# EAGLE design TinyRX4 (EAGLE 6.4)
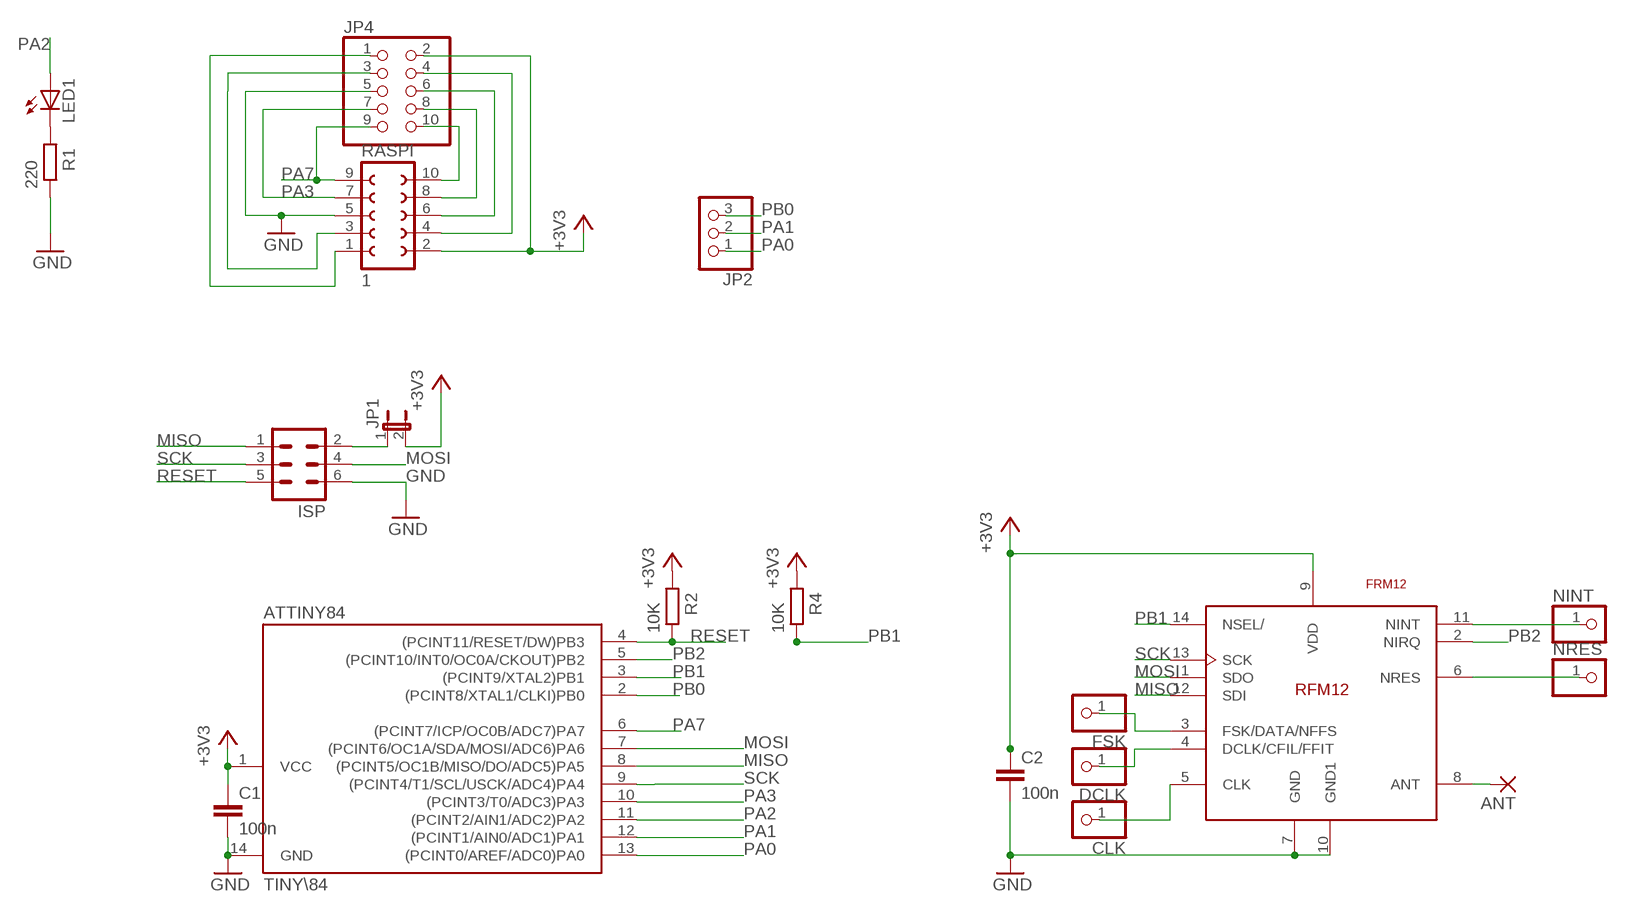
[diagram p0: schematic, sheet 1]

## Parts
ANT  1,6/0,8  [1,6/0,8]
ATTINY84  TINY\84  TINY24/44/84-SSU  [SOIC14]
C1  100n  C-EUC0805  [C0805]
C2  100n  C-EUC0805  [C0805]
CLK  PINHD-1X1  [1X01]
DCLK  PINHD-1X1  [1X01]
FSK  PINHD-1X1  [1X01]
ISP  ML6  [ML6]
JP1  JUMPER-2PTH  [1X02]
JP2  PINHD-1X3  [1X03]
JP4  PINHD-2X5  [2X05]
LED1  LEDSML0805  [SML0805]
NINT  PINHD-1X1  [1X01]
NRES  PINHD-1X1  [1X01]
R1  220  R-EU_R0805  [R0805]
R2  10K  R-EU_R0805  [R0805]
R4  10K  R-EU_R0805  [R0805]
RASPI  1  FE05-2  [FE05-2]
U$1  FRM12  [RFM12]

## Nets
+3V3 [power]: ATTINY84.1(VCC) C1.1 C2.1 JP1.2 JP4.2 R2.2 R4.2 RASPI.2 U$1.9(VDD)
GND [power]: ATTINY84.14(GND) C1.2 C2.2 ISP.6 JP4.5 R1.1 RASPI.5 U$1.7(GND) U$1.10(GND1)
MISO: ATTINY84.8((PCINT5/OC1B/MISO/DO/ADC5)PA5) ISP.1 U$1.12(SDI)
MOSI: ATTINY84.7((PCINT6/OC1A/SDA/MOSI/ADC6)PA6) ISP.4 U$1.1(SDO)
N$1: ISP.2 JP1.1
N$2: JP4.10 RASPI.10
N$3: LED1.C R1.2
N$4: JP4.8 RASPI.8
N$5: JP4.6 RASPI.6
N$6 [power]: ANT.1(P) U$1.8(ANT)
N$7: JP4.4 RASPI.4
N$9: JP4.1 RASPI.1
N$10: JP4.3 RASPI.3
N$15: NINT.1 U$1.11(NINT)
N$16: CLK.1 U$1.5(CLK)
N$17: DCLK.1 U$1.4(DCLK/CFIL/FFIT)
N$18: NRES.1 U$1.6(NRES)
N$19: FSK.1 U$1.3(FSK/DATA/NFFS)
PA0: ATTINY84.13((PCINT0/AREF/ADC0)PA0) JP2.1
PA1 [power]: ATTINY84.12((PCINT1/AIN0/ADC1)PA1) JP2.2
PA2: ATTINY84.11((PCINT2/AIN1/ADC2)PA2) LED1.A
PA3: ATTINY84.10((PCINT3/T0/ADC3)PA3) JP4.7 RASPI.7
PA7: ATTINY84.6((PCINT7/ICP/OC0B/ADC7)PA7) JP4.9 RASPI.9
PB0: ATTINY84.2((PCINT8/XTAL1/CLKI)PB0) JP2.3
PB1: ATTINY84.3((PCINT9/XTAL2)PB1) R4.1 U$1.14(NSEL/)
PB2: ATTINY84.5((PCINT10/INT0/OC0A/CKOUT)PB2) U$1.2(NIRQ)
RESET: ATTINY84.4((PCINT11/RESET/DW)PB3) ISP.5 R2.1
SCK: ATTINY84.9((PCINT4/T1/SCL/USCK/ADC4)PA4) ISP.3 U$1.13(SCK)

## Library data of the parts
ANT = JeeLabs:1,6/0,8: THROUGH-HOLE PAD
ATTINY84 = avr-7:TINY24/44/84
C1 C2 = rcl:C-EU: CAPACITOR, European symbol
CLK DCLK FSK NINT NRES = pinhead:PINHD-1X1: PIN HEADER
ISP = con-harting-ml:ML6: HARTING; OC_FARNELL: unknown; OC_NEWARK: unknown
JP1 = SparkFun:JUMPER-2: Jumper Basic 0.1" spaced jumper. Use with breakaway headers.
JP2 = pinhead:PINHD-1X3: PIN HEADER
JP4 = pinhead:PINHD-2X5: PIN HEADER
LED1 = led:LED: LED OSRAM: - CHIPLED LG R971, LG N971, LY N971, LG Q971, LY Q971, LO R971, LY R971 LH N974, LH R974 LS Q976, LO Q976, LY Q976 LO Q996 - Hyper CHIPLED LW Q18S LB Q993, LB Q99A, LB R99A - SideLED LS A670, LO A670, LY A670, LG A670, LP A670 LB A673, LV A673, LT A673, LW A673 LH A674 LY A675 LS A676, LA A676, LO A676, LY A676, LW A676 LS A679, LY A679, LG A679 - Hyper Micro SIDELED® LS Y876, LA Y876, LO Y876, LY Y876 LT Y87S - SmartLED LW L88C, LW L88S LB L89C, LB L89S, LG L890 LS L89K, LO L89K, LY L89K LS L896, LA L896, LO L896, LY L896 - TOPLED LS T670, LO T670, LY T670, LG T670, LP T670 LSG T670, LSP T670, LSY T670, LOP T670, LYG T670 LG T671, LOG T671, LSG T671 LB T673, LV T673, LT T673, LW T673 LH T674 LS T676, LA T676, LO T676, LY T676, LB T676, LH T676, LSB T676, LW T676 LB T67C, LV T67C, LT T67C, LS T67K, LO T67K, LY T67K, LW E67C LS E67B, LA E67B, LO E67B, LY E67B, LB E67C, LV E67C, LT E67C LW T67C LS T679, LY T679, LG T679 LS T770, LO T770, LY T770, LG T770, LP T770 LB T773, LV T773, LT T773, LW T773 LH T774 LS E675, LA E675, LY E675, LS T675 LS T776, LA T776, LO T776, LY T776, LB T776 LHGB T686 LT T68C, LB T68C - Hyper Mini TOPLED® LB M676 - Mini TOPLED Santana® LG M470 LS M47K, LO M47K, LY M47K Source: http://www.osram.convergy.de LUXEON: - LUMILED® LXK2-PW12-R00, LXK2-PW12-S00, LXK2-PW14-U00, LXK2-PW14-V00 LXK2-PM12-R00, LXK2-PM12-S00, LXK2-PM14-U00 LXK2-PE12-Q00, LXK2-PE12-R00, LXK2-PE12-S00, LXK2-PE14-T00, LXK2-PE14-U00 LXK2-PB12-K00, LXK2-PB12-L00, LXK2-PB12-M00, LXK2-PB14-N00, LXK2-PB14-P00, LXK2-PB14-Q00 LXK2-PR12-L00, LXK2-PR12-M00, LXK2-PR14-Q00, LXK2-PR14-R00 LXK2-PD12-Q00, LXK2-PD12-R00, LXK2-PD12-S00 LXK2-PH12-R00, LXK2-PH12-S00 LXK2-PL12-P00, LXK2-PL12-Q00, LXK2-PL12-R00 Source: www.luxeon.com KINGBRIGHT: KA-3528ASYC Source: www.kingbright.com
R1 R2 R4 = rcl:R-EU_: RESISTOR, European symbol
RASPI = con-lsta:FE05-2: FEMALE HEADER; OC_FARNELL: unknown; OC_NEWARK: unknown
U$1 = RFM12:FRM12

## Net classes
0 default: width 0.254 mm, drill 0.254 mm, clearance 0.254 mm
1 power: width 0.305 mm, drill 0.305 mm, clearance 0.305 mm

## Board
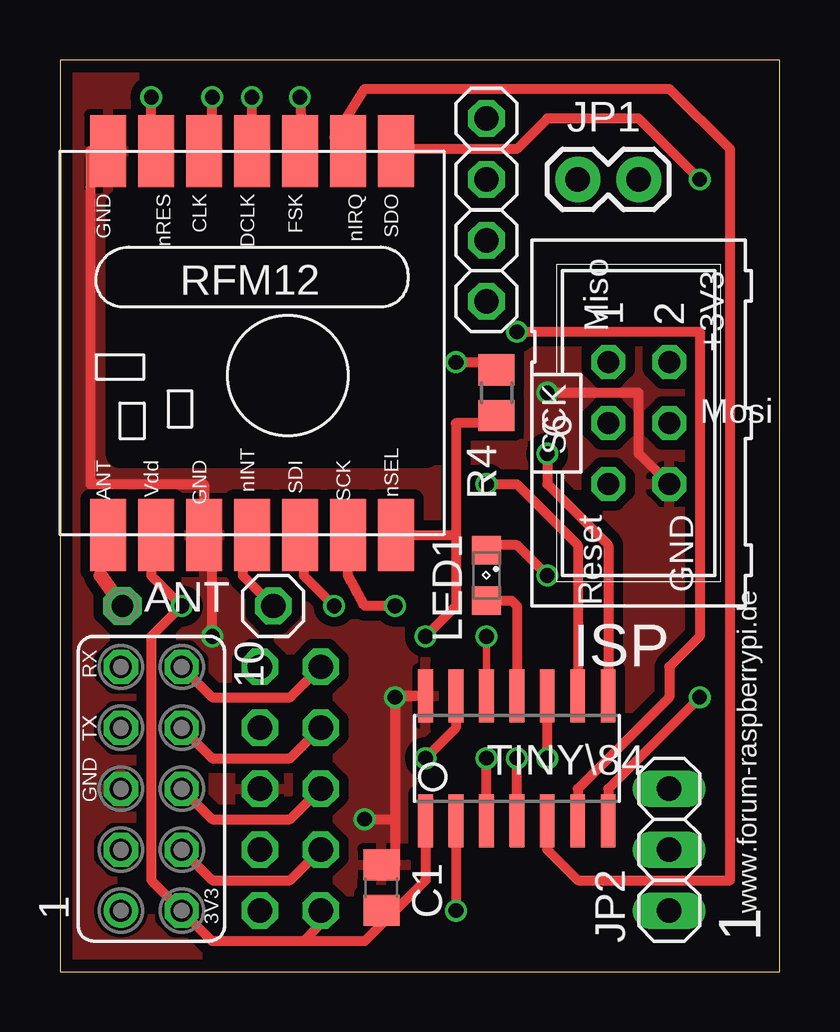
[diagram p1: board, top side]
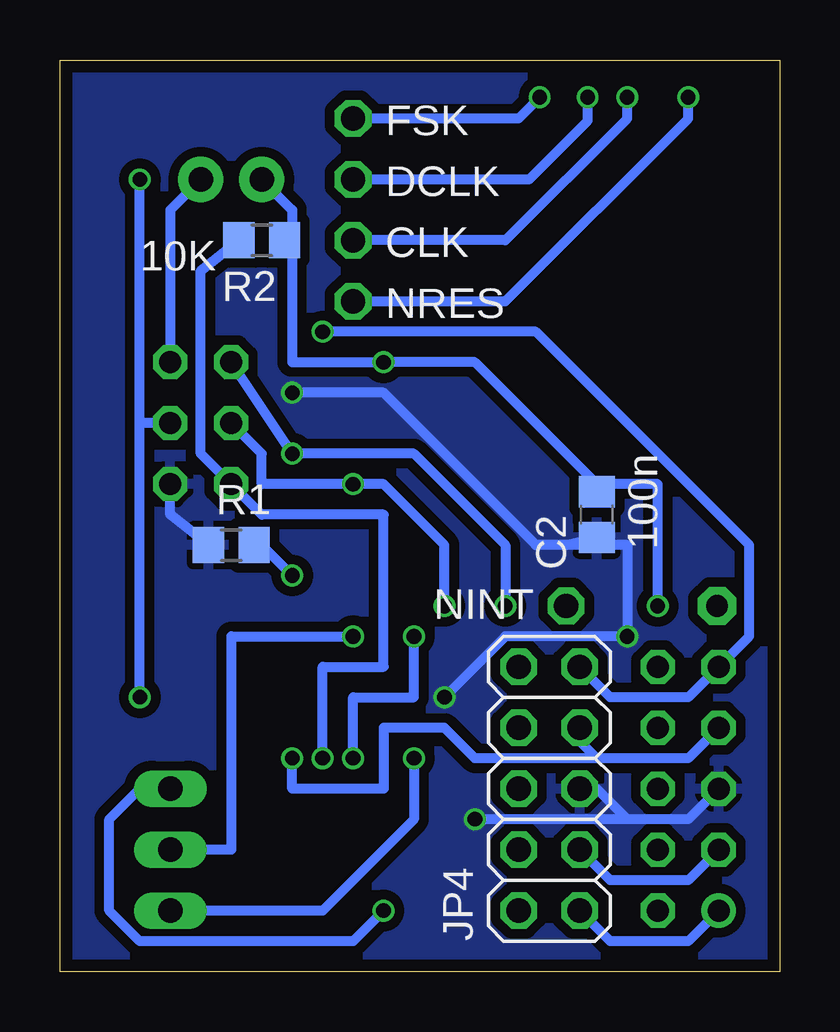
[diagram p2: board, bottom side, seen from below]

Size 30 x 38 mm. Coordinates in mm from the lower left corner, seen from the top.
Outline: 0,0 30,0 30,38 0,38 0,0
Copper layers (1*16): Top 0.035mm / dielectric 1.5mm / Bottom 0.035mm
Design rules "smartprototyping": minimum track width 7mil, minimum drill 12mil, track to track 7mil, track to pad 7mil, pad to pad 7mil, via to via 7mil, smd to smd 0mil, copper to edge 20mil, drill to drill 10mil, minimum pad ring 10mil, minimum via ring 6mil, stop-mask expansion 2mil, vias tented up to drill 25mil, thermal gap 10mil
tRestrict: area 2.5,21.6 to 15.2,32

### Footprints (pad centres in the part's own frame; a part is rotated, then mirrored left to right if it is on the bottom)
1,6/0,8 = drill 0.9 pad 1.6 octagon: 1 0,0
SOIC14 = smd 0.61 x 2.21: 1 -3.81,-2.603; 2 -2.54,-2.603; 3 -1.27,-2.603; 4 0,-2.603; 5 1.27,-2.603; 6 2.54,-2.603; 7 3.81,-2.603; 8 3.81,2.603; 9 2.54,2.603; 10 1.27,2.603; 11 0,2.603; 12 -1.27,2.603; 13 -2.54,2.603; 14 -3.81,2.603
C0805 = smd 1.3 x 1.5: 1 -0.95,0; 2 0.95,0
1X01 = drill 1.016 octagon: 1 0,0
ML6 = drill 0.914 octagon: 1 -2.54,-1.27; 2 -2.54,1.27; 3 0,-1.27; 4 0,1.27; 5 2.54,-1.27; 6 2.54,1.27
1X02 = drill 1.016 pad 1.88: 1 0,0; 2 2.54,0
1X03 = drill 1.016 long: 1 -2.54,0; 2 0,0; 3 2.54,0
2X05 = drill 1.016 octagon: 1 -5.08,-1.27; 2 -5.08,1.27; 3 -2.54,-1.27; 4 -2.54,1.27; 5 0,-1.27; 6 0,1.27; 7 2.54,-1.27; 8 2.54,1.27; 9 5.08,-1.27; 10 5.08,1.27
SML0805 = smd 1.2 x 1.2: A 1.05,0; C -1.05,0
R0805 = smd 1.3 x 1.5: 1 -0.95,0; 2 0.95,0
FE05-2 = drill 0.914: 1 -5.08,1.27 | drill 0.914 octagon: 2 -5.08,-1.27; 3 -2.54,1.27; 4 -2.54,-1.27; 5 0,1.27; 6 0,-1.27; 7 2.54,1.27; 8 2.54,-1.27; 9 5.08,1.27; 10 5.08,-1.27
RFM12 = smd 1.5 x 3: 1 -5,-10; 2 -3,-10; 3 -1,-10; 4 1,-10; 5 3,-10; 6 5,-10; 7 7,-10; 8 7,6; 9 5,6; 10 3,6; 11 1,6; 12 -1,6; 13 -3,6; 14 -5,6

### Placement (x,y rotation side)
ANT  2.6,15.24 0 top
ATTINY84  19.05,8.89 0 top
C1  13.4,3.5 90 top
C2  7.62,19.05 270 bottom
CLK  17.78,30.48 0 top
DCLK  17.78,33.02 0 top
FSK  17.78,35.56 0 top
ISP  24.13,22.86 270 top
JP1  24.13,33.02 180 top
JP2  25.4,5.08 90 top
JP4  9.6,7.62 90 bottom
LED1  17.78,16.51 270 top
NINT  8.89,15.24 0 top
NRES  17.78,27.94 0 top
R1  22.86,17.78 0 bottom
R2  21.59,30.48 0 bottom
R4  18.2,24.13 90 top
RASPI  3.81,7.62 90 top
U$1  9,24.2 180 top

### Tracks (layer width: path | path; a pad name or v marks a point on that pad's centre or on a via)
+3V3  (via drill 0.61)
  Top 0.406: ATTINY84.1 15.24,3.81 13.97,2.54 | 13.97,2.54 12.7,1.27 10.16,1.27 | 10.16,1.27 6.35,1.27 RASPI.2 3.81,3.81 3.81,13.97 v5.08,15.24 3.81,16.51 3.81,18.67 4,18.67 U$1.9 | C1.1 13.65,2.86 13.97,2.54 | JP4.2 10.87,1.98 10.16,1.27 | v16.51,25.4 17.78,25.4 R4.2
  Bottom 0.406: v5.08,15.24 5.08,20.32 7.62,20.32 | JP1.2 20.32,31.75 20.32,30.48 | 20.32,30.48 20.32,25.4 v16.51,25.4 12.7,25.4 7.62,20.32 | 7.62,20.32 C2.1 | R2.2 20.32,30.48
GND  (via drill 0.61)
  Top 0.406: ISP.6 24.13,21.59 24.13,24.13 v20.32,24.13 | v13.97,11.43 ATTINY84.14 13.97,11.49 v13.97,11.43 | v13.97,11.43 13.97,6.35 | 13.97,6.35 13.97,4.45 C1.2 | v12.7,6.35 13.97,6.35 | U$1.10 6.35,18.5 | U$1.10 6.35,18.15 v6.35,13.97 | U$1.10 6,20.32 1.27,20.32 1.27,34.2 U$1.7
  Bottom 0.406: RASPI.5 3.81,6.35 6.35,6.35 | 6.35,6.35 v12.7,6.35 | R1.1 25.4,19.05 ISP.6 | v20.32,24.13 16.51,24.13 10.16,17.78 8.89,17.78 | 8.89,17.78 6.35,17.78 v6.35,13.97 11.43,13.97 v13.97,11.43 | 8.89,17.78 C2.2 | JP4.5 7.62,7.62 6.35,6.35
  pour Bottom (isolate 0.406): 0,38.1 30.48,38.1 30.48,0 0,0
  pour Top (isolate 0.406): 30.48,0 0,0 0,38.1 30.48,38.1
MISO  (via drill 0.61)
  Top 0.254: 22.86,11.43 ATTINY84.8
  Top 0.406: v20.32,21.59 20.32,20.32 22.86,17.78 ATTINY84.8 | U$1.12 10.16,18.5 10.16,16.51 v11.43,15.24
  Bottom 0.406: ISP.1 v20.32,21.59 15.24,21.59 11.43,17.78 v11.43,15.24
MOSI  (via drill 0.61)
  Top 0.254: 13.97,34.29 U$1.1
  Top 0.406: v26.67,33.02 24.13,35.56 20.32,35.56 19.05,34.29 13.97,34.29 | v26.67,11.43 22.86,7.62 ATTINY84.7
  Bottom 0.406: 26.67,22.86 v26.67,33.02 | v26.67,11.43 26.67,22.86 | ISP.4 26.67,22.86
N$1
  Bottom 0.406: JP1.1 25.4,31.75 ISP.2
N$2
  Top 0.406: RASPI.10 6.35,11.43 9.6,11.43 JP4.10
N$3  (via drill 0.61)
  Top 0.406: v20.32,16.51 19.05,17.78 17.78,17.78 LED1.C
  Bottom 0.406: v20.32,16.51 21.59,17.78 R1.2
N$4
  Top 0.406: RASPI.8 6.35,8.89 9.6,8.89 JP4.8
N$5
  Top 0.406: RASPI.6 6.35,6.35 9.6,6.35 JP4.6
N$6
  Top 0.406: U$1.8 1.7,18.5 1.7,16.51
  Top 0.61: ANT.1 1.7,16.51
N$7
  Top 0.406: RASPI.4 6.35,3.81 9.6,3.81 JP4.4
N$9
  Bottom 0.406: RASPI.1 3.81,1.27 7.06,1.27 JP4.1
N$10
  Bottom 0.406: RASPI.3 3.81,3.81 7.06,3.81 JP4.3
N$15
  Top 0.406: U$1.11 7.62,18.5 7.62,16.51 NINT.1
N$16  (via drill 0.61)
  Top 0.406: U$1.5 6.35,34.5 v6.35,36.45
  Bottom 0.406: CLK.1 11.43,30.48 6.35,35.56 v6.35,36.45
N$17  (via drill 0.61)
  Top 0.406: 7.62,34.2 U$1.4 v8,36.45
  Bottom 0.406: DCLK.1 10.45,33.02 8,35.47 v8,36.45
N$18  (via drill 0.61)
  Top 0.406: U$1.6 3.81,34.5 v3.81,36.45
  Bottom 0.406: NRES.1 11.43,27.94 3.81,35.56 v3.81,36.45
N$19  (via drill 0.61)
  Top 0.406: U$1.3 10.16,34.5 v10,36.45
  Bottom 0.406: FSK.1 10.89,35.56 v10,36.45
PA0  (via drill 0.61)
  Top 0.406: ATTINY84.13 16.51,10.16 v15.24,8.89
  Bottom 0.406: v15.24,8.89 15.24,6.35 19.05,2.54 JP2.1
PA1  (via drill 0.61)
  Top 0.305: v17.78,13.97 ATTINY84.12
  Bottom 0.406: v17.78,13.97 22.86,13.97 22.86,5.08 JP2.2
PA2
  Top 0.254: 19.05,11.43 ATTINY84.11
  Top 0.406: LED1.A 18.83,15.46 19.05,15.24 ATTINY84.11
PA3  (via drill 0.61)
  Top 0.406: v20.32,8.89 ATTINY84.10
  Bottom 0.406: RASPI.7 3.81,8.89 7.62,8.89 | 7.62,8.89 12.7,8.89 13.97,10.16 16.51,10.16 16.51,7.62 20.32,7.62 v20.32,8.89 | JP4.7 8.33,9.6 7.62,8.89
PA7  (via drill 0.61)
  Top 0.406: ATTINY84.6 21.59,7.62 25.4,11.43 25.4,12.7 26.67,13.97 26.67,26.67 v19.05,26.67
  Bottom 0.406: v19.05,26.67 10.16,26.67 1.27,17.78 1.27,13.97 RASPI.9 3.81,11.43 7.06,11.43 JP4.9
PB0  (via drill 0.61)
  Top 0.406: ATTINY84.2 v16.51,2.54
  Bottom 0.406: v16.51,2.54 17.78,1.27 26.67,1.27 27.94,2.54 27.94,6.35 26.67,7.62 JP2.3
PB1  (via drill 0.61)
  Top 0.406: ATTINY84.3 v17.78,8.89 | v15.24,13.97 16.51,15.24 16.51,17.78 16.51,18.2 | 16.51,18.2 16.51,22.86 18.2,22.86 R4.1 | U$1.14 16.51,18.2
  Bottom 0.406: v17.78,8.89 17.78,11.43 15.24,11.43 v15.24,13.97
PB2
  Top 0.406: ATTINY84.5 20.32,5.08 21.59,3.81 27.94,3.81 27.94,34.29 25.4,36.8 12.7,36.8 11.43,34.77 U$1.2 12,34.67
RESET  (via drill 0.61)
  Top 0.406: ATTINY84.4 v19.05,8.89
  Bottom 0.406: R2.1 24.13,29.21 24.13,21.59 ISP.5 21.59,19.05 16.51,19.05 16.51,12.7 19.05,12.7 v19.05,8.89
SCK  (via drill 0.61)
  Top 0.406: v17.78,20.32 19.05,20.32 21.59,17.78 ATTINY84.9 | v13.97,15.24 12.7,15.24 12,16.51 U$1.13
  Bottom 0.406: v13.97,15.24 13.97,17.78 16.51,20.32 v17.78,20.32 21.59,20.32 21.59,21.59 ISP.3

### Text on the board
tNames: +3V3 | Miso | Mosi | SCK | Reset | GND | RX | TX | TX | GND | 3V3 | www.forum-raspberrypi.de | 1